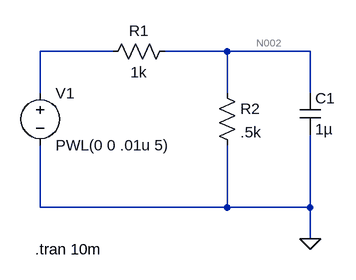
[diagram p0: schematic C_DC.asc]
C_DC.asc, the LTspice schematic file:
Version 4
SHEET 1 880 680
WIRE 128 128 16 128
WIRE 304 128 208 128
WIRE 432 128 304 128
WIRE 16 192 16 128
WIRE 304 192 304 128
WIRE 432 192 432 128
WIRE 16 368 16 272
WIRE 304 368 304 272
WIRE 304 368 16 368
WIRE 432 368 432 256
WIRE 432 368 304 368
WIRE 432 416 432 368
FLAG 432 416 0
SYMBOL res 224 112 R90
WINDOW 0 0 56 VBottom 2
WINDOW 3 32 56 VTop 2
SYMATTR InstName R1
SYMATTR Value 1k
SYMBOL res 288 176 R0
SYMATTR InstName R2
SYMATTR Value .5k
SYMBOL cap 416 192 R0
SYMATTR InstName C1
SYMATTR Value 1µ
SYMBOL voltage 16 176 R0
WINDOW 123 0 0 Left 0
WINDOW 39 0 0 Left 0
SYMATTR InstName V1
SYMATTR Value PWL(0 0 .01u 5)
TEXT 8 432 Left 2 !.tran 10m

The netlist it stands for:
* C_DC.asc
R1 N002 N001 1k
R2 N002 0 .5k
C1 N002 0 1µ
V1 N001 0 PWL(0 0 .01u 5)
.tran 10m
.backanno
.end

* Results of the author's LTspice run, read from the files saved beside the schematic
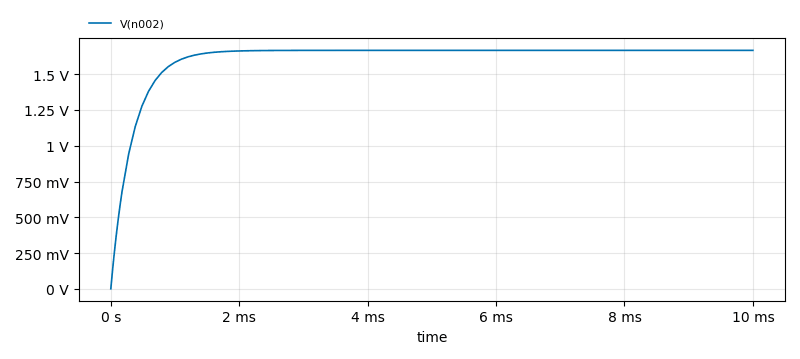
[diagram p1: Transient Analysis of C_DC.asc, plotted from the saved traces]
* Transient Analysis, 1 run:
*   V(n002): min 0 V, max 1.667 V, average 1.611 V, rms 1.624 V, last 1.667 V